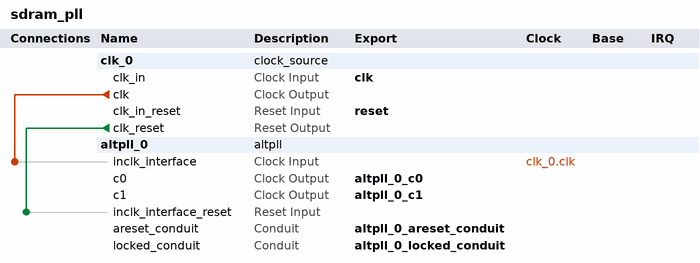
[diagram p0: system contents]
# Platform Designer (Qsys) system sdram_pll, Cyclone II EP2C20F484C7
# Parameters at their usual value, and those the tool derives, are not listed.
package require -exact qsys 13.0
create_system sdram_pll
set_project_property DEVICE_FAMILY {Cyclone II}
set_project_property DEVICE EP2C20F484C7

add_instance clk_0 clock_source 13.0
set_instance_parameter_value clk_0 clockFrequency 50000000

add_instance altpll_0 altpll 13.0
set_instance_parameter_value altpll_0 INCLK0_INPUT_FREQUENCY 20000
set_instance_parameter_value altpll_0 COMPENSATE_CLOCK CLK1
set_instance_parameter_value altpll_0 GATE_LOCK_SIGNAL NO
set_instance_parameter_value altpll_0 VALID_LOCK_MULTIPLIER 1
set_instance_parameter_value altpll_0 INVALID_LOCK_MULTIPLIER 5
set_instance_parameter_value altpll_0 CLK0_MULTIPLY_BY 1
set_instance_parameter_value altpll_0 CLK1_MULTIPLY_BY 1
set_instance_parameter_value altpll_0 CLK0_DIVIDE_BY 1
set_instance_parameter_value altpll_0 CLK1_DIVIDE_BY 1
set_instance_parameter_value altpll_0 CLK1_PHASE_SHIFT -3000
set_instance_parameter_value altpll_0 CLK1_DUTY_CYCLE 50
set_instance_parameter_value altpll_0 PORT_clk1 PORT_USED
set_instance_parameter_value altpll_0 PORT_clk2 PORT_UNUSED
set_instance_parameter_value altpll_0 PORT_clk3 PORT_UNUSED
set_instance_parameter_value altpll_0 PORT_ARESET PORT_USED
set_instance_parameter_value altpll_0 PORT_LOCKED PORT_UNUSED

# connections
add_connection clk_0.clk altpll_0.inclk_interface clock
add_connection clk_0.clk_reset altpll_0.inclk_interface_reset reset

# exported interfaces
add_interface clk clock sink
set_interface_property clk EXPORT_OF clk_0.clk_in
add_interface reset reset sink
set_interface_property reset EXPORT_OF clk_0.clk_in_reset
add_interface altpll_0_c0 clock source
set_interface_property altpll_0_c0 EXPORT_OF altpll_0.c0
add_interface altpll_0_c1 clock source
set_interface_property altpll_0_c1 EXPORT_OF altpll_0.c1
add_interface altpll_0_areset_conduit conduit end
set_interface_property altpll_0_areset_conduit EXPORT_OF altpll_0.areset_conduit
add_interface altpll_0_locked_conduit conduit end
set_interface_property altpll_0_locked_conduit EXPORT_OF altpll_0.locked_conduit

set_interconnect_requirement {$system} qsys_mm.clockCrossingAdapter HANDSHAKE
set_interconnect_requirement {$system} qsys_mm.maxAdditionalLatency 1

save_system sdram_pll.qsys
